# Altium project RP2040LED.PrjPcb
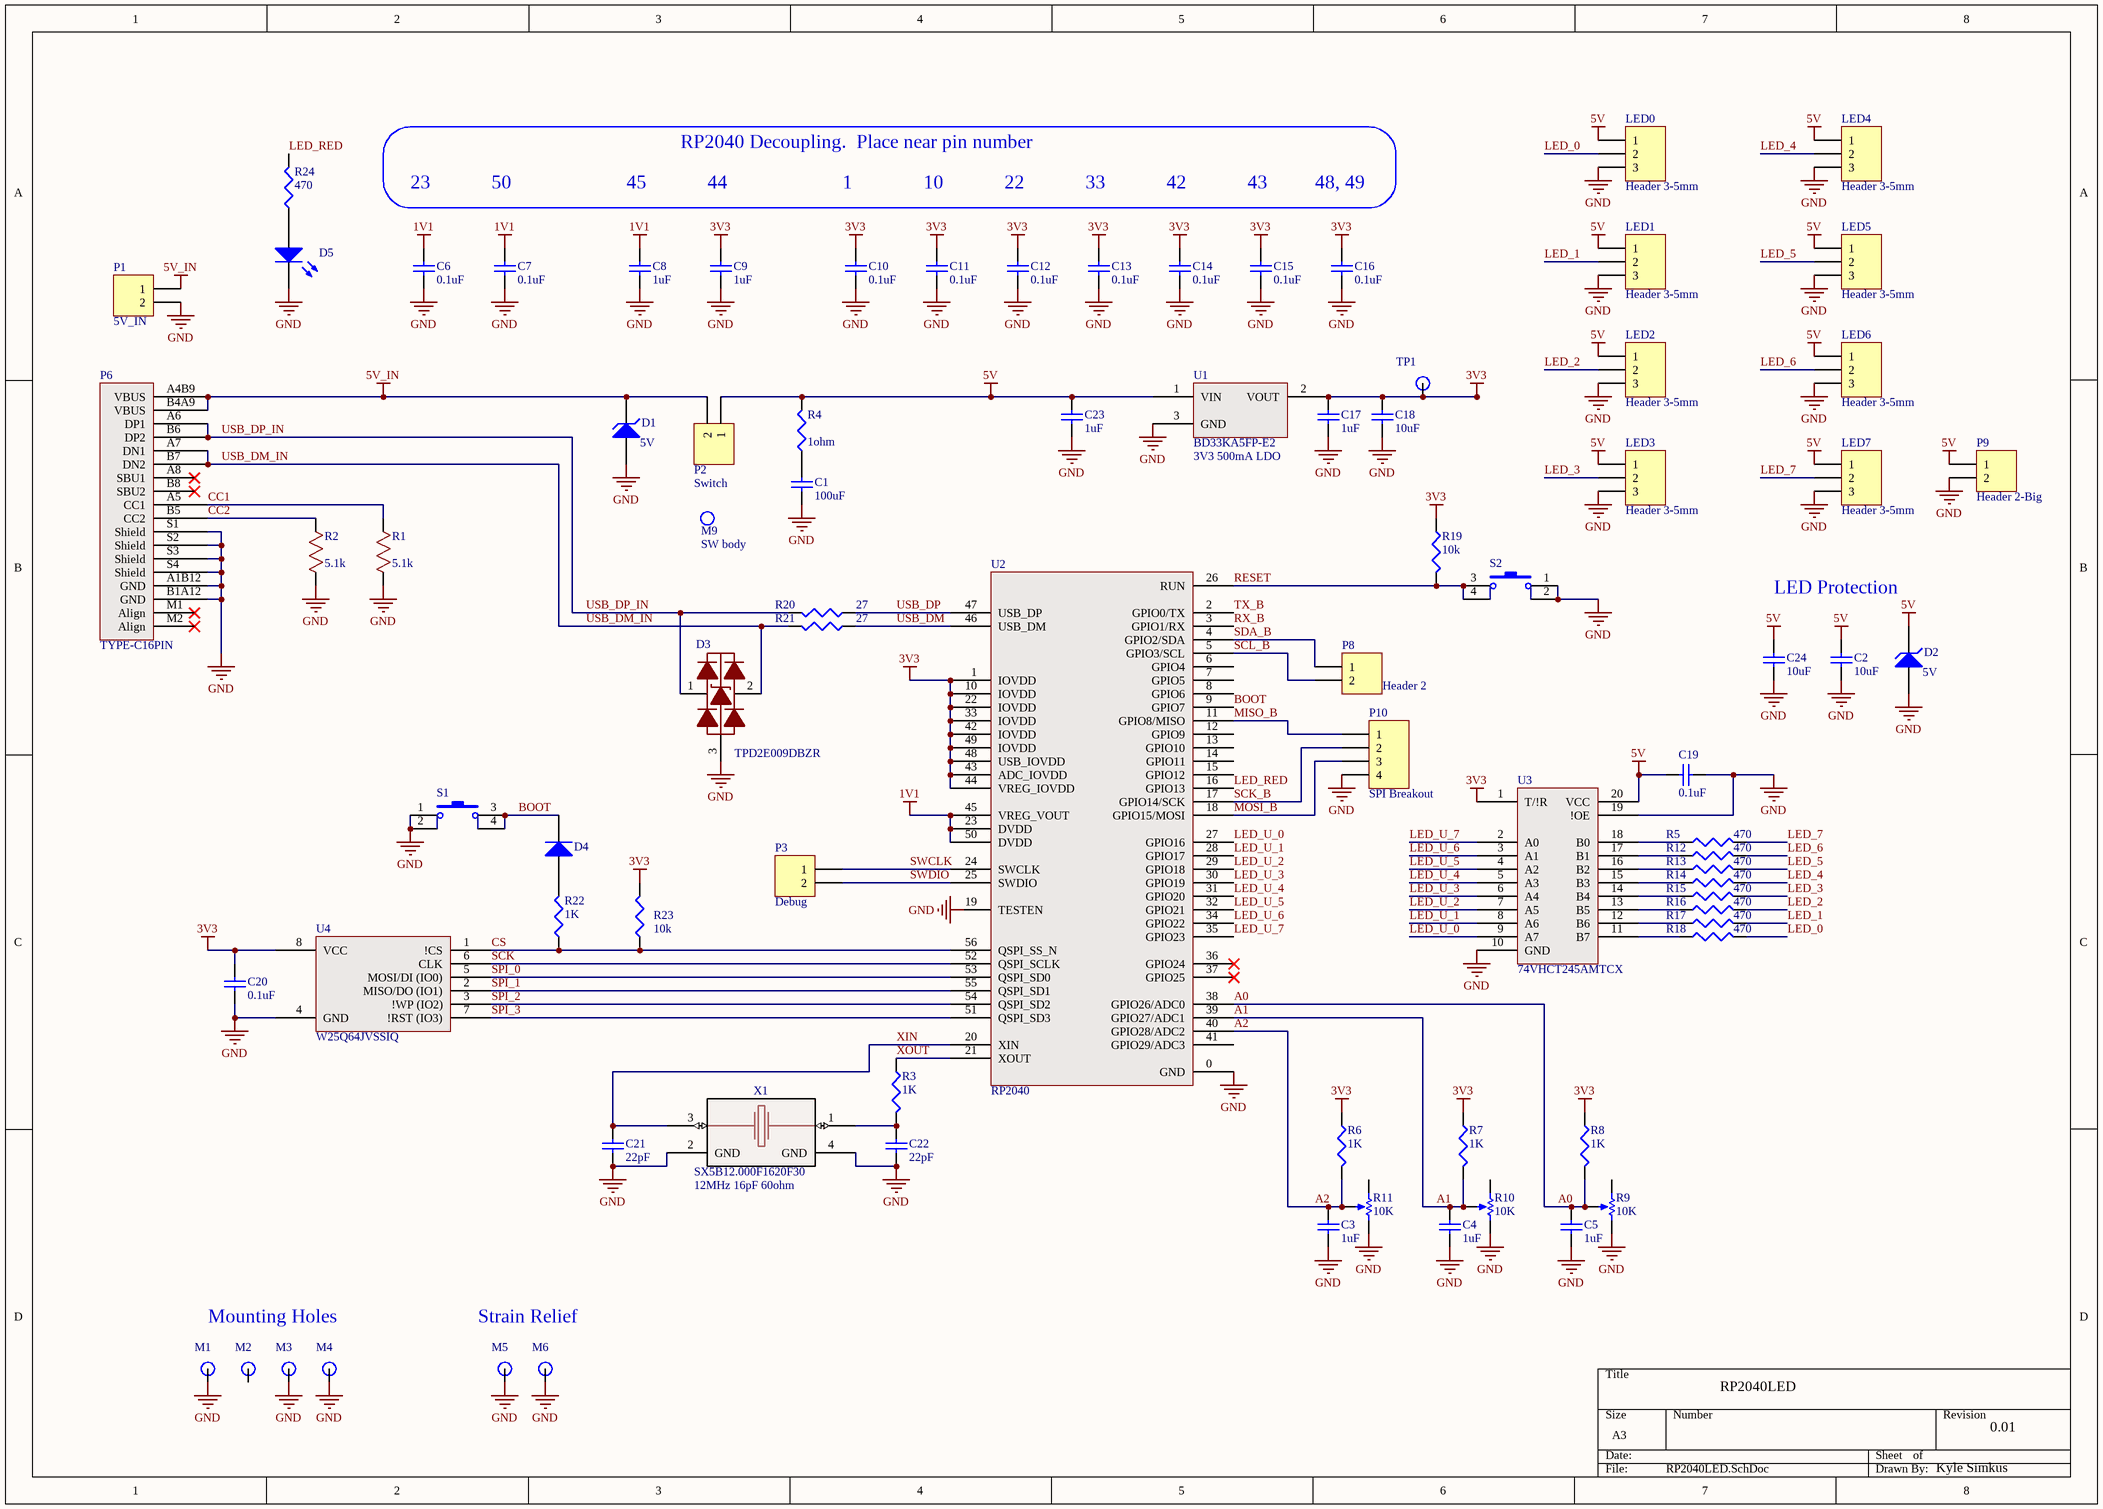
[diagram p0: RP2040LED.SchDoc]
1 sheet, 83 parts. Net scope: global (net labels, ports and power ports of the same name join across sheets).

## Sheet RP2040LED.SchDoc
size A3

### Parts
C1  value 100uF  [1210 [3225] - C]  (hidden comment: CAP)
C2  value 10uF  [0805 [2012] - C]
C3  value 1uF  [0603C]
C4  value 1uF  [0603C]
C5  value 1uF  [0603C]
C6  value 0.1uF  [0402C]
C7  value 0.1uF  [0402C]
C8  value 1uF  [0603C]
C9  value 1uF  [0603C]
C10  value 0.1uF  [0402C]
C11  value 0.1uF  [0402C]
C12  value 0.1uF  [0402C]
C13  value 0.1uF  [0402C]
C14  value 0.1uF  [0402C]
C15  value 0.1uF  [0402C]
C16  value 0.1uF  [0402C]
C17  value 1uF  [0603C]
C18  value 10uF  [0805 [2012] - C]
C19  value 0.1uF  [0603C]
C20  value 0.1uF  [0603C]
C21  value 22pF  [0603C]
C22  value 22pF  [0603C]
C23  value 1uF  [0603C]
C24  value 10uF  [0805 [2012] - C]
D1  value 5V  [SMA DO-214AC]  (hidden comment: D Zener)
D2  value 5V  [SMA DO-214AC]  (hidden comment: D Zener)
D3  DK MPN: TPD2E009DBZR  [SOT23-3-TPD2E009DBZR]  (hidden comment: D_TVS-BI2C_SOT23)
D4  (no value)  [DO-214AC-C95872]
D5  (no value)  [0603LED-KT-0603R]
LED0  Header 3-5mm  [Header3-5mm]  (no BOM)
LED1  Header 3-5mm  [Header3-5mm]  (no BOM)
LED2  Header 3-5mm  [Header3-5mm]  (no BOM)
LED3  Header 3-5mm  [Header3-5mm]  (no BOM)
LED4  Header 3-5mm  [Header3-5mm]  (no BOM)
LED5  Header 3-5mm  [Header3-5mm]  (no BOM)
LED6  Header 3-5mm  [Header3-5mm]  (no BOM)
LED7  Header 3-5mm  [Header3-5mm]  (no BOM)
M1  Mounting hole  [MOUNT_3mm_5mm]  (value not drawn)  (no BOM)
M2  Mounting hole  [MOUNT_3mm_5mm]  (value not drawn)  (no BOM)
M3  Mounting hole  [MOUNT_3mm_5mm]  (value not drawn)  (no BOM)
M4  Mounting hole  [MOUNT_3mm_5mm]  (value not drawn)  (no BOM)
M5  Mounting hole  [MOUNT_3mm_5mm]  (value not drawn)  (no BOM)
M6  Mounting hole  [MOUNT_3mm_5mm]  (value not drawn)  (no BOM)
M9  no pins  [Rocker Switch - BODY]  (value not drawn)  (no BOM)
P1  5V_IN  [Header2-BIG]  (no BOM)
P2  Switch  [Header2-BIG]  (no BOM)
P3  Debug  [HDR1X2]  (no BOM)
P6  JLC MPN: TYPE-C16PIN  [USB-TYPE-C16PIN]  (hidden comment: USB-C)
P8  Header 2  [HDR1X2]  (no BOM)
P9  Header 2-Big  [Header2-BIG]  (no BOM)
P10  SPI Breakout  [HDR1X4]  (no BOM)
R1  value 5.1k  [0603R]  (hidden comment: R_RES_0603)
R2  value 5.1k  [0603R]  (hidden comment: R_RES_0603)
R3  value 1K  [0603R]  (hidden comment: Res3)
R4  value 1ohm  [0805R]  (hidden comment: Res3)
R5  value 470  [0603R]
R6  value 1K  [0603R]  (hidden comment: Res3)
R7  value 1K  [0603R]  (hidden comment: Res3)
R8  value 1K  [0603R]  (hidden comment: Res3)
R9  value 10K  [TrimPot-ext-Knob]  (hidden comment: RPot)  (no BOM)
R10  value 10K  [TrimPot-ext-Knob]  (hidden comment: RPot)  (no BOM)
R11  value 10K  [TrimPot-ext-Knob]  (hidden comment: RPot)  (no BOM)
R12  value 470  [0603R]
R13  value 470  [0603R]
R14  value 470  [0603R]
R15  value 470  [0603R]
R16  value 470  [0603R]
R17  value 470  [0603R]
R18  value 470  [0603R]
R19  value 10k  [0603R]
R20  value 27  [0603R]
R21  value 27  [0603R]
R22  value 1K  [0603R]  (hidden comment: Res3)
R23  value 10k  [0603R]
R24  value 470  [0603R]  (hidden comment: 470ohm)
S1  SW-PB  [SW_KMR211GLFS]  (value not drawn)
S2  SW-PB  [SW_KMR211GLFS]  (value not drawn)
TP1  3V3  [TestPoint 0.9mm 2mm]  (value not drawn)  (no BOM)
U1  JLC MPN: BD33KA5FP-E2  Note: 3V3 500mA LDO  [TO-252-3-BD33KA5FP-E2]  (hidden comment: LDO-BD33KA5FP-E2)
U2  RP2040  [56-QFN-RP2040]
U3  74VHCT245AMTCX  [20-TSSOP-74VHCT245AMTCX]
U4  FLASH  [8-SOIC-W25Q64JVSSIQ]  (value not drawn)
X1  value 12MHz 16pF 60ohm  JLC MPN: SX5B12.000F1620F30  [4-SMD-XTAL-C2901628]  (hidden comment: X_XTAL_4SMD)

### Nets
1V1: C6.1 C7.1 C8.1 U2.23(DVDD) U2.45(VREG_VOUT) U2.50(DVDD)
3V3: C9.1 C10.1 C11.1 C12.1 C13.1 C14.1 C15.1 C16.1 C17.1 C18.2 C20.2 R6.2 R7.2 R8.2 R19.1 R23.2 TP1.1(TP) U1.2(VOUT) U2.1(IOVDD) U2.10(IOVDD) U2.22(IOVDD) U2.33(IOVDD) U2.42(IOVDD) U2.43(ADC_IOVDD) U2.44(VREG_IOVDD) U2.48(USB_IOVDD) U2.49(IOVDD) U3.1(T/!R) U4.8(VCC)
5V: C2.2 C19.1 C23.1 C24.2 D2.2(K) LED0.1 LED1.1 LED2.1 LED3.1 LED4.1 LED5.1 LED6.1 LED7.1 P2.1 P9.1 R4.2 U1.1(VIN) U3.20(VCC)
5V_IN: D1.2(K) P1.1 P2.2 P6.A4B9(VBUS) P6.B4A9(VBUS)
GND: C1.1 C2.1 C3.2 C4.2 C5.2 C6.2 C7.2 C8.2 C9.2 C10.2 C11.2 C12.2 C13.2 C14.2 C15.2 C16.2 C17.2 C18.1 C19.2 C20.1 C21.2 C22.2 C23.2 C24.1 D1.1(A) D2.1(A) D3.3(GND) D5.2(K) LED0.3 LED1.3 LED2.3 LED3.3 LED4.3 LED5.3 LED6.3 LED7.3 M1.1(TP) M3.1(TP) M4.1(TP) M5.1(TP) M6.1(TP) P1.2 P6.A1B12(GND) P6.B1A12(GND) P6.S1(Shield) P6.S2(Shield) P6.S3(Shield) P6.S4(Shield) P9.2 P10.4 R1.2 R2.2 R9.2(BOT) R10.2(BOT) R11.2(BOT) S1.1 S1.2 S2.1 S2.2 U1.3(GND) U2.0(GND) U2.19(TESTEN) U3.10(GND) U3.19(!OE) U4.4(GND) X1.2(GND) X1.4(GND)
A0: C5.1 R8.1 R9.3(TAP) U2.38(GPIO26/ADC0)
A1: C4.1 R7.1 R10.3(TAP) U2.39(GPIO27/ADC1)
A2: C3.1 R6.1 R11.3(TAP) U2.40(GPIO28/ADC2)
BOOT: D4.2(K) S1.3 S1.4 U2.9(GPIO7)
CC1: P6.A5(CC1) R1.1
CC2: P6.B5(CC2) R2.1
CS: R22.1 R23.1 U2.56(QSPI_SS_N) U4.1(!CS)
LED_0: LED0.2 R18.2
LED_1: LED1.2 R17.2
LED_2: LED2.2 R16.2
LED_3: LED3.2 R15.2
LED_4: LED4.2 R14.2
LED_5: LED5.2 R13.2
LED_6: LED6.2 R12.2
LED_7: LED7.2 R5.2
LED_RED: R24.2 U2.16(GPIO13)
LED_U_0: U2.27(GPIO16) U3.9(A7)
LED_U_1: U2.28(GPIO17) U3.8(A6)
LED_U_2: U2.29(GPIO18) U3.7(A5)
LED_U_3: U2.30(GPIO19) U3.6(A4)
LED_U_4: U2.31(GPIO20) U3.5(A3)
LED_U_5: U2.32(GPIO21) U3.4(A2)
LED_U_6: U2.34(GPIO22) U3.3(A1)
LED_U_7: U2.35(GPIO23) U3.2(A0)
MISO_B: P10.1 U2.11(GPIO8/MISO)
MOSI_B: P10.3 U2.18(GPIO15/MOSI)
RESET: R19.2 S2.3 S2.4 U2.26(RUN)
RX_B: U2.3(GPIO1/RX)
SCK: U2.52(QSPI_SCLK) U4.6(CLK)
SCK_B: P10.2 U2.17(GPIO14/SCK)
SCL_B: P8.2 U2.5(GPIO3/SCL)
SDA_B: P8.1 U2.4(GPIO2/SDA)
SPI_0: U2.53(QSPI_SD0) U4.5(MOSI/DI_(IO0))
SPI_1: U2.55(QSPI_SD1) U4.2(MISO/DO_(IO1))
SPI_2: U2.54(QSPI_SD2) U4.3(!WP_(IO2))
SPI_3: U2.51(QSPI_SD3) U4.7(!RST_(IO3))
SWCLK: P3.1 U2.24(SWCLK)
SWDIO: P3.2 U2.25(SWDIO)
TX_B: U2.2(GPIO0/TX)
USB_DM: R21.1 U2.46(USB_DM)
USB_DM_IN: D3.2(D-) P6.A7(DN1) P6.B7(DN2) R21.2
USB_DP: R20.1 U2.47(USB_DP)
USB_DP_IN: D3.1(D+) P6.A6(DP1) P6.B6(DP2) R20.2
XIN: C21.1 U2.20(XIN) X1.3(X2)
XOUT: R3.1 U2.21(XOUT)
NetC1_2: C1.2 R4.1
NetC22_1: C22.1 R3.2 X1.1(X1)
NetD4_1: D4.1(A) R22.2
NetD5_1: D5.1(A) R24.1
NetR5_1: R5.1 U3.18(B0)
NetR12_1: R12.1 U3.17(B1)
NetR13_1: R13.1 U3.16(B2)
NetR14_1: R14.1 U3.15(B3)
NetR15_1: R15.1 U3.14(B4)
NetR16_1: R16.1 U3.13(B5)
NetR17_1: R17.1 U3.12(B6)
NetR18_1: R18.1 U3.11(B7)

Not connected (* = marked no-connect by the designer): M2 1(TP); P6 A8(SBU1)* B8(SBU2)* M1(Align)* M2(Align)*; R9 1(TOP); R10 1(TOP); R11 1(TOP); U2 6(GPIO4) 7(GPIO5) 8(GPIO6) 12(GPIO9) 13(GPIO10) 14(GPIO11) 15(GPIO12) 36(GPIO24)* 37(GPIO25)* 41(GPIO29/ADC3)

### Notes on the sheet
- RP2040 Decoupling.  Place near pin number
- 23
- 50
- 45
- 44
- 1
- 10
- 22
- 33
- 42
- 43
- 48, 49
- LED Protection
- Mounting Holes
- Strain Relief
- RP2040LED
- 0.01
- Kyle Simkus
- (in symbol Mech) SW body

### Library data of the parts
C1 = Cap Semi: 10V 100uF X5R ±20% 1210  Multilayer Ceramic Capacitors MLCC - SMD/SMT ROHS; Voltage: 10V; JLC MPN: CL32A107MPVNNNE; JLC PN: C23742
C2 C18 C24 = Cap Semi: MULTILAYER CERAMIC CAPACITORS MLCC - SMD/SMT 10UF 25V 0805 ROHS; MPN: CL21A106KOQNNNE; Voltage: V; JLC MPN: CL21A106KAYNNNE; JLC PN: C15850
C3-C5 C8 C9 C17 C23 = Cap Semi: MULTILAYER CERAMIC CAPACITORS MLCC - SMD/SMT 1UF 50V 0603 ROHS; MPN: CL10A105KA8NNNC; Voltage: V; JLC MPN: CL10A105KB8NNNC; JLC PN: C15849
C6 C7 C10-C16 = Cap Semi: MULTILAYER CERAMIC CAPACITORS MLCC - SMD/SMT 100NF 50V 0603 ROHS; MPN: CL05B104KB54PNC; Voltage: V; JLC MPN: CL05B104KB54PNC; JLC PN: C307331
C19 C20 = Cap Semi: MULTILAYER CERAMIC CAPACITORS MLCC - SMD/SMT 100NF 50V 0603 ROHS; MPN: CL10B104KB8NNNC; Voltage: V; JLC MPN: CC0603KRX7R9BB104; JLC PN: C14663
C21 C22 = Cap Semi: 50V 22pF C0G ±5% 0603  Multilayer Ceramic Capacitors MLCC - SMD/SMT ROHS; MPN: CL10C220JB8NNNC; Voltage: 50V; JLC MPN: CL10C220JB8NNNC; JLC PN: C1653
D1 D2 = D Zener: TVS DIODE 5VWM 9.2VC DO214AC; MPN-tiny: SP1003-01DTG; MPN-small: SD05T1G; MPN-very-small: VESD05A1-02V-G-18; MPN-big: SMBJ5.0A; Manufacturer: Vishay; MPN: SMAJ5.0A-E3/61; JLC MPN: SMAJ5.0A-E3/61; JLC PN: C89363
D3 = D00332: IC ESD-Protection ARRAY Dual High Speed SOT23-3; Value: 5.5V; Rating: 45W 8KV; Title: IC ESD-Protection ARRAY Dual High Speed SOT23-3; JLC PN: C2871371; MPN: TPD2E009DBZR; JLC MPN: TPD2E009DBZR
D4 = Diode: 1A 1kV 1.1V@1A SMA(DO-214AC) Diodes - General Purpose; Value: 1.1V 1A; JLC PN: C95872; JLC MPN: M7
D5 = LED1: LED red 0603 20mA 2V; Value: 2V 20mA; JLC MPN: KT-0603R; JLC PN: C2286
LED0-LED7 = Header 3: Header, 3-Pin; DNP: DNP
M1-M6 = TestPoint: DNP: DNP
M9 = Mech: DNP: DNP
P1 P3 P8 P9 = Header 2: Header, 2-Pin
  P3: LatestRevisionDate: 17-Jul-2002; LatestRevisionNote: Re-released for DXP Platform.; Publisher: Altium Limited
  P8: DNP: DNP
P2 = Header 2: Header, 2-Pin; DK MPN: RRG31131100; amazon link: https://www.amazon.ca/dp/B07SPVPQPL
P6 = USB-C: 3A 1 Surface Mount 16P Female -40℃~+85℃ Type-C SMD  USB Connectors ROHS; JLC PN: C393939; Value: USB
P10 = Header 4: Header, 4-Pin; LatestRevisionDate: 17-Jul-2002; LatestRevisionNote: Re-released for DXP Platform.; Publisher: Altium Limited
R1 R2 = R00703: CHIP RESISTOR - SURFACE MOUNT 5.1KOHMS ±1% 1/10W 0603 ROHS; DK MPN: RC0603FR-075K1L; Category: Resistor; JLC MPN: 0603WAF5101T5E; JLC PN: C23186
R3 R6-R8 R22 = Res3: 100mW Thick Film Resistors ±5% ±200ppm/℃ 1000ohm 0603  Chip Resistor - Surface Mount ROHS; JLC MPN: ERJ3GEYJ102V; JLC PN: C180848
R4 = Res3: RES 1 OHM 5% 1/2W 0805; JLC MPN: ESR10EZPJ1R0; JLC PN: C253344
R5 R12-R18 R24 = Res3: CHIP RESISTOR - SURFACE MOUNT 470OHMS ±1% 1/10W 0603 ROHS; MPN: ERJ-3EKF4700V; JLC MPN: 0603WAF4700T5E; JLC PN: C23179
R9-R11 = RPot: Potentiometer; MFG: WMYCONGCONG; DK 3D model: PDB181-E420F-103B1; link: https://www.amazon.ca/dp/B07B64MWRF/ref=sspa_dk_detail_4?
R19 R23 = Res3: CHIP RESISTOR - SURFACE MOUNT 10KOHMS ±1% 1/10W 0603 ROHS; MPN: ERJ-3GEYJ103V; JLC MPN: 0603WAF1002T5E; JLC PN: C25804
R20 R21 = Res3: 100mW Thick Film Resistors ±1% ±200ppm/℃ 27ohm 0603 Chip Resistor - Surface Mount ROHS; MPN: 0603WAF270JT5E; JLC MPN: 0603WAF270JT5E; JLC PN: C25190
S1 S2 = SW-PB: 0.05A Brick nogging SPST - NO 120gf 32V SMD  Tactile Switches ROHS; MPN-big: TL3305CF260QG; MPN-straight: KMR211GLFS; MPN-RA: PTS840 PK SMTR LFS; DK PN: EG5355CT-ND; DK MPN: KMR211GLFS; JLC MPN: KMR211GLFS; JLC PN: C221675
TP1 = TestPoint: Test Point; DNP: DNP
U1 = LDO-BD33KA5FP-E2: 500mA 50dB@(120Hz) Fixed 3.3V Positive 5.5V TO-252; JLC PN: C161949; Voltage: 3.3V
U2 = RP2040: RPi RP2040 133MHz 32bit dual core 30 I/O 264K x8 4x12bit ADC; JLC PN: C2040; JLC MPN: RP2040
U3 = 74VHCT245AMTCX: 8 8mA 4.5V~5.5V 8mA 1 TSSOP-20  Buffer/Driver/Transceiver ROHS; MFG: onsemi; JLC PN: C903431; JLC MPN: 74VHCT245AMTCX
U4 = W25Q64JVSSIQ: SOP-8-208mil  NOR FLASH ROHS; JLC PN: C179171; JLC MPN: W25Q64JVSSIQ
X1 = X_XTAL_4: 12MHz 16pF ±20ppm SMD5032-4P 60ohm; MFG: Shenzhen SCTF Elec; Link: https://jlcpcb.com/partdetail/Jyje-5TJ412000NYGBC/C2149262; JLC PN: C2901628